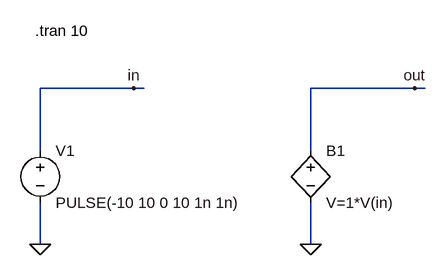
[diagram p0: schematic perfectly-linear.asc]
perfectly-linear.asc, the LTspice schematic file:
Version 4
SHEET 1 916 680
WIRE 48 0 -96 0
WIRE 64 0 48 0
WIRE 480 0 320 0
WIRE 496 0 480 0
WIRE -96 96 -96 0
WIRE 320 96 320 0
WIRE -96 240 -96 176
WIRE 320 240 320 176
FLAG -96 240 0
FLAG 48 0 in
FLAG 320 240 0
FLAG 480 0 out
SYMBOL External\\voltage -96 80 R0
WINDOW 123 0 0 Left 0
WINDOW 39 0 0 Left 0
SYMATTR InstName V1
SYMATTR Value PULSE(-10 10 0 10 1n 1n)
SYMBOL bv 320 80 R0
SYMATTR InstName B1
SYMATTR Value V=1*V(in)
TEXT -104 -88 Left 2 !.tran 10

The netlist it stands for:
* perfectly-linear.asc
V1 in 0 PULSE(-10 10 0 10 1n 1n)
B1 out 0 V=1*V(in)
.tran 10
.backanno
.end